# EAGLE design ns2 (EAGLE 5.09)
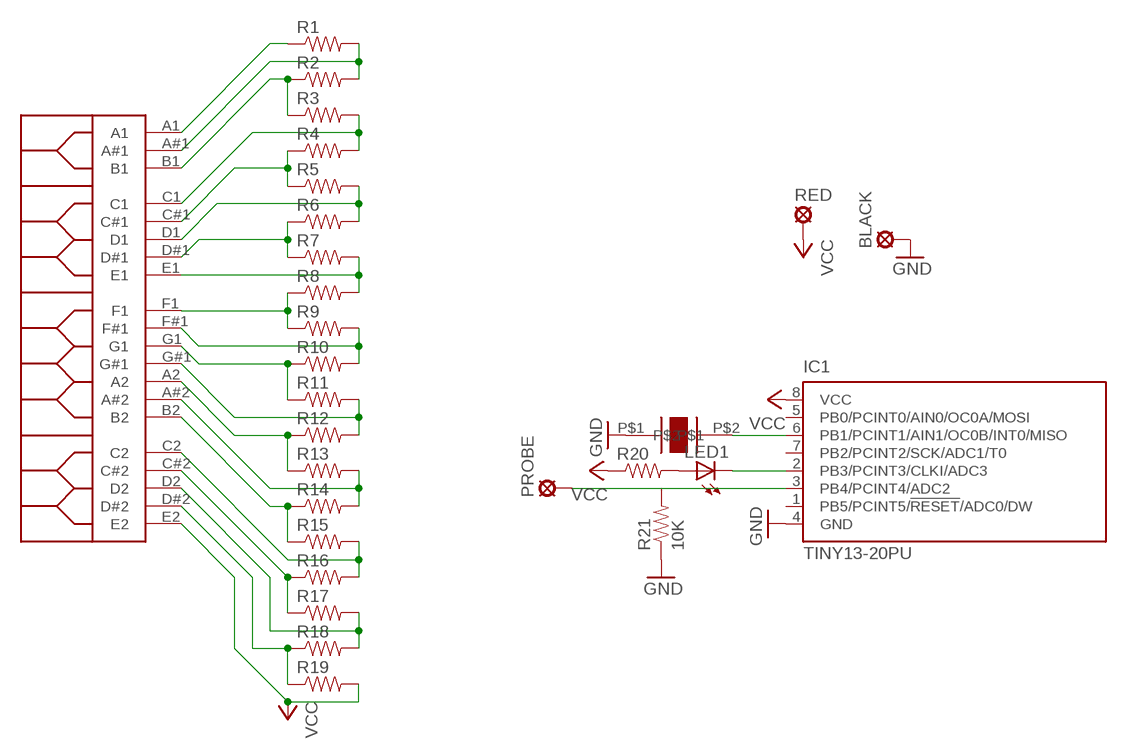
[diagram p0: schematic, sheet 1]

## Parts
BLACK  LSP10  [LSP10]
IC1  TINY13-20PU  [DIL08]
LED1  LED3MM  [LED3MM]
PROBE  LSP10  [LSP10]
R1  RESISTORPTH-1/4W  [AXIAL-0.4]
R2  RESISTORPTH-1/4W  [AXIAL-0.4]
R3  RESISTORPTH-1/4W  [AXIAL-0.4]
R4  RESISTORPTH-1/4W  [AXIAL-0.4]
R5  RESISTORPTH-1/4W  [AXIAL-0.4]
R6  RESISTORPTH-1/4W  [AXIAL-0.4]
R7  RESISTORPTH-1/4W  [AXIAL-0.4]
R8  RESISTORPTH-1/4W  [AXIAL-0.4]
R9  RESISTORPTH-1/4W  [AXIAL-0.4]
R10  RESISTORPTH-1/4W  [AXIAL-0.4]
R11  RESISTORPTH-1/4W  [AXIAL-0.4]
R12  RESISTORPTH-1/4W  [AXIAL-0.4]
R13  RESISTORPTH-1/4W  [AXIAL-0.4]
R14  RESISTORPTH-1/4W  [AXIAL-0.4]
R15  RESISTORPTH-1/4W  [AXIAL-0.4]
R16  RESISTORPTH-1/4W  [AXIAL-0.4]
R17  RESISTORPTH-1/4W  [AXIAL-0.4]
R18  RESISTORPTH-1/4W  [AXIAL-0.4]
R19  RESISTORPTH-1/4W  [AXIAL-0.4]
R20  RESISTORPTH-1/4W  [AXIAL-0.4]
R21  10K  RESISTORPTH-1/4W  [AXIAL-0.4]
RED  LSP10  [LSP10]
U$1  STYLOPHONE  STYLOPHONENANO  [NANO-KEYBOARD]
U$2  PS1420P02AT  [PS1420P02AT]

## Nets
GND: BLACK.MP IC1.4(GND) R21.P$1 U$2.P$1
N$1: R1.P$2 R2.P$2 U$1.A#1
N$2: R3.P$2 R4.P$2 U$1.C1
N$3: R5.P$2 R6.P$2 U$1.D1
N$4: R7.P$2 R8.P$2 U$1.E1
N$5: R9.P$2 R10.P$2 U$1.F#1
N$6: R11.P$2 R12.P$2 U$1.G#1
N$7: R13.P$2 R14.P$2 U$1.A#2
N$8: R15.P$2 R16.P$2 U$1.C2
N$9: R17.P$2 R18.P$2 U$1.D2
N$10: R18.P$1 R19.P$1 U$1.D#2
N$11: R16.P$1 R17.P$1 U$1.C#2
N$12: R14.P$1 R15.P$1 U$1.B2
N$13: R12.P$1 R13.P$1 U$1.A2
N$14: R10.P$1 R11.P$1 U$1.G1
N$15: R8.P$1 R9.P$1 U$1.F1
N$16: R6.P$1 R7.P$1 U$1.D#1
N$17: R4.P$1 R5.P$1 U$1.C#1
N$18: R2.P$1 R3.P$1 U$1.B1
N$19: IC1.3(PB4/PCINT4/ADC2) PROBE.MP R21.P$2
N$20: IC1.6(PB1/PCINT1/AIN1/OC0B/INT0/MISO) U$2.P$2
N$21: IC1.2(PB3/PCINT3/CLKI/ADC3) LED1.K(C)
N$22: LED1.A R20.P$2
N$23: R1.P$1 U$1.A1
VCC: IC1.8(VCC) R19.P$2 R20.P$1 RED.MP U$1.E2
Unconnected: IC1.1(PB5/PCINT5/!RESET!/ADC0/DW) IC1.5(PB0/PCINT0/AIN0/OC0A/MOSI) IC1.7(PB2/PCINT2/SCK/ADC1/T0)

## Library data of the parts
BLACK PROBE RED = solpad:LSP10: SOLDER PAD drill 1.0 mm, distributor Buerklin, 12H555
IC1 = atmel:TINY13: 8-bit AVR Microcontroller with 1K Bytes In-System Programmable Flash Source: http://www.atmel.com/dyn/resources/prod_documents/2535S.pdf
LED1 = SparkFun:LED: LEDs Standard schematic elements and footprints for 5mm, 3mm, 1206, and 0603 sized LEDs. 5mm - Spark Fun Electronics SKU : COM-00529 (and others)
R1-R21 = SparkFun:RESISTOR: Resistor Basic schematic elements and footprints for 0603, 1206, and PTH resistors.
U$1 = stlkb:STYLOPHONE
U$2 = piezo:PS1420P02AT

## Board
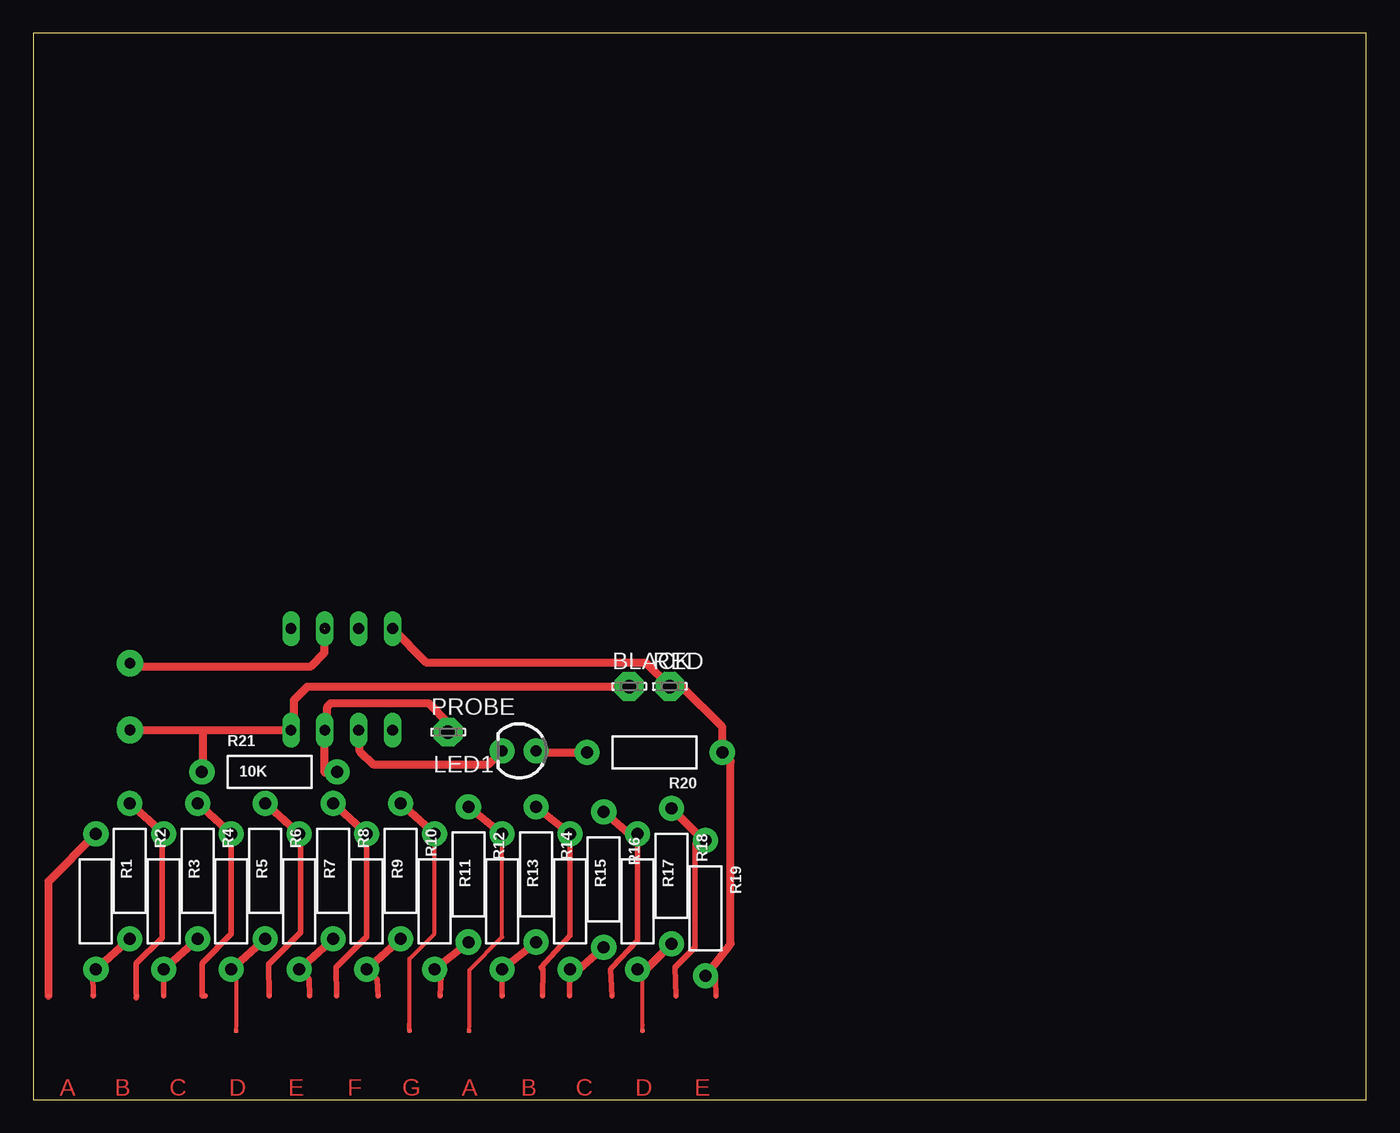
[diagram p1: board, top side]
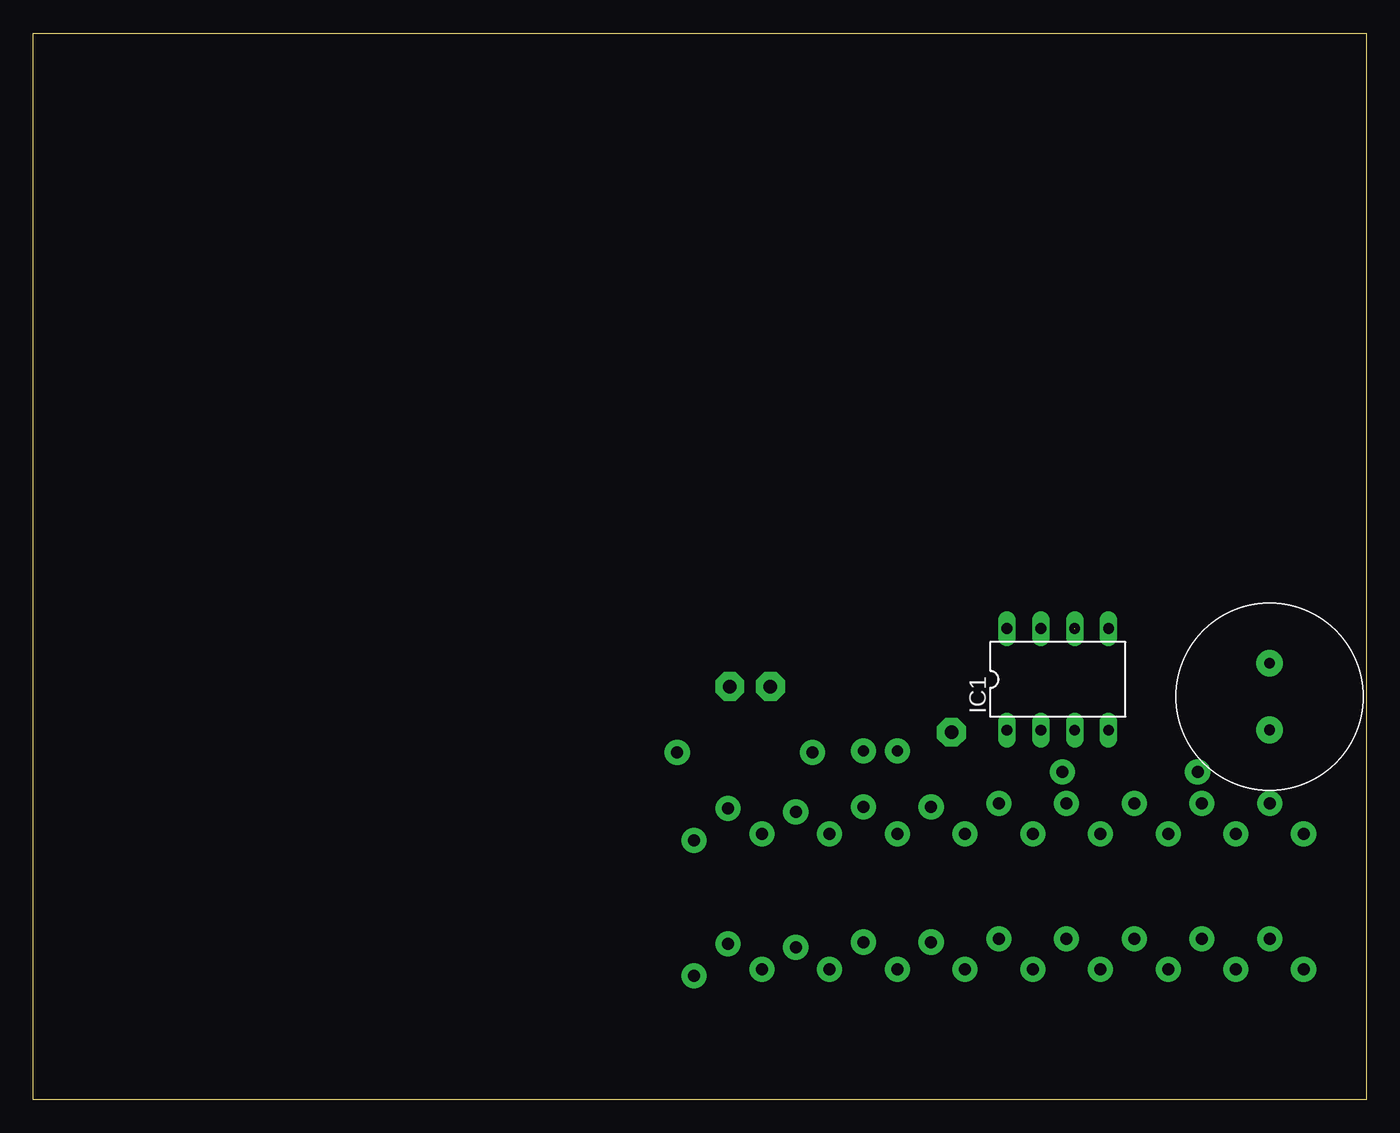
[diagram p2: board, bottom side, seen from below]

Size 100 x 80 mm. Coordinates in mm from the lower left corner, seen from the top.
Outline: 0,0 100,0 100,80 0,80 0,0
Copper layers (1*16): Top 0.035mm / dielectric 1.5mm / Bottom 0.035mm
Design rules "default": minimum track width 10mil, minimum drill 24mil, track to track 8mil, track to pad 8mil, pad to pad 8mil, via to via 8mil, smd to smd 8mil, copper to edge 40mil, drill to drill 8mil, minimum pad ring 10mil, minimum via ring 8mil, stop-mask expansion 4mil, vias tented up to drill 0mil, thermal gap 10mil

### Footprints (pad centres in the part's own frame; a part is rotated, then mirrored left to right if it is on the bottom)
LSP10 = drill 1.016 pad 2.159 octagon: MP 0,0
DIL08 = drill 0.813 long: 1 -3.81,-3.81; 2 -1.27,-3.81; 3 1.27,-3.81; 4 3.81,-3.81; 5 3.81,3.81; 6 1.27,3.81; 7 -1.27,3.81; 8 -3.81,3.81
LED3MM = drill 0.813 pad 1.88 round: A -1.27,0; K 1.27,0
AXIAL-0.4 = drill 0.9 pad 1.88 round: P$1 -5.08,0; P$2 5.08,0
NANO-KEYBOARD = smd 0.305 x 0.152: A1 0.762,-0.076; A2 32.309,-2.718; A#1 4.115,-0.076; A#2 34.798,-0.076; B1 7.366,-0.076; B2 37.821,-0.076; C1 9.398,-0.076; C2 39.853,-0.076; C#1 12.497,-0.076; C#2 43.028,-0.076; D1 14.834,-2.718; D2 45.314,-2.718; D#1 17.323,-0.076; D#2 47.828,-0.076; E1 20.345,-0.076; E2 50.825,-0.076; F1 22.377,-0.076; F#1 25.502,-0.076; G1 27.838,-2.718; G#1 30.15,-0.076
PS1420P02AT = drill 0.8 pad 2 round: P$1 -2.5,0; P$2 2.5,0

### Placement (x,y rotation side)
BLACK  44.7,30.99 0 top
IC1  23.14,31.52 0 bottom
LED1  36.45,26.16 180 top
PROBE  31.11,27.56 0 top
R1  4.7,14.86 270 top
R2  7.24,17.14 270 top
R3  9.78,14.86 270 top
R4  12.32,17.14 270 top
R5  14.86,14.86 270 top
R6  17.4,17.14 270 top
R7  19.94,14.86 270 top
R8  22.48,17.14 270 top
R9  25.02,14.86 270 top
R10  27.56,17.14 270 top
R11  30.1,14.86 270 top
R12  32.64,16.89 270 top
R13  35.18,14.86 270 top
R14  37.72,16.89 270 top
R15  40.26,14.86 270 top
R16  42.8,16.51 270 top
R17  45.34,14.86 270 top
R18  47.88,16.76 270 top
R19  50.42,14.35 270 top
R20  46.61,26.04 180 top
R21  17.73,24.59 0 top
RED  47.75,30.99 0 top
U$1  0.38,7.87 0 top
U$2  7.24,30.23 90 bottom

### Tracks (layer width: path | path; a pad name or v marks a point on that pad's centre or on a via)
GND
  Top 0.61: BLACK.MP 20.57,30.99 19.56,29.97 19.56,27.94 IC1.4 19.32,27.73 12.7,27.73 | U$2.P$1 12.7,27.73 | R21.P$1 12.7,24.64 12.7,27.73
N$1
  Top 0.406: R1.P$2 4.45,9.53 U$1.A#1
  Top 0.61: R1.P$2 R2.P$2
N$2
  Top 0.406: U$1.C1 R3.P$2
  Top 0.61: R3.P$2 R4.P$2
N$3
  Top 0.305: R5.P$2 15.24,9.4 15.24,5.59 U$1.D1
  Top 0.61: R5.P$2 R6.P$2
N$4
  Top 0.406: R7.P$2 20.7,9.02 U$1.E1
  Top 0.61: R7.P$2 R8.P$2
N$5
  Top 0.406: R9.P$2 25.78,9.02 U$1.F#1
  Top 0.61: R9.P$2 R10.P$2
N$6
  Top 0.406: R11.P$2 30.61,9.27 U$1.G#1
  Top 0.61: R11.P$2 R12.P$2
N$7
  Top 0.406: U$1.A#2 R13.P$2
  Top 0.61: R13.P$2 R14.P$2
N$8
  Top 0.406: U$1.C2 R15.P$2
  Top 0.61: R16.P$2 40.89,9.78 R15.P$2
N$9
  Top 0.305: 45.72,9.4 45.72,5.59 U$1.D2
  Top 0.406: 45.72,9.4 R17.P$2
  Top 0.61: R18.P$2 45.97,9.78 R17.P$2
N$10
  Top 0.406: R19.P$1 49.66,19.18 49.66,11.43 48.13,9.91 U$1.D#2
  Top 0.61: R18.P$1 49.78,19.94 R19.P$1
N$11
  Top 0.406: R17.P$1 45.34,11.94 43.43,9.91 43.31,9.78 U$1.C#2
  Top 0.61: R16.P$1 44.7,19.94 R17.P$1
N$12
  Top 0.406: R15.P$1 40.26,12.32 38.1,9.91 38.23,9.78 U$1.B2
  Top 0.61: R15.P$1 R14.P$1
N$13
  Top 0.305: R13.P$1 35.18,12.19 32.72,9.73 32.72,5.61 U$1.A2
  Top 0.61: R13.P$1 R12.P$1
N$14
  Top 0.305: R11.P$1 30.1,12.45 28.22,10.57 28.22,5.79 arc16 U$1.G1
  Top 0.61: R11.P$1 R10.P$1
N$15
  Top 0.406: R9.P$1 25.02,12.19 22.73,9.91 U$1.F1
  Top 0.61: R9.P$1 R8.P$1
N$16
  Top 0.406: R7.P$1 20.07,19.81 20.07,12.55 17.65,10.13 U$1.D#1
  Top 0.61: R7.P$1 R6.P$1
N$17
  Top 0.406: R5.P$1 14.86,12.42 12.68,10.24 12.68,7.77 U$1.C#1
  Top 0.61: R5.P$1 R4.P$1
N$18
  Top 0.406: R3.P$1 9.65,19.81 9.65,12.14 7.72,10.21 7.72,7.64 U$1.B1
  Top 0.61: R3.P$1 R2.P$1
N$19
  Top 0.61: R21.P$2 21.87,24.51 IC1.3 21.89,27.69 22.05,27.84 22.05,29.46 22.33,29.74 29.64,29.74 31.11,28.27 PROBE.MP
N$20  (1 unrouted)
  Top 0.61: 21.84,35.31 21.84,33.53 20.83,32.51 7.45,32.51 U$2.P$2
N$21
  Top 0.61: LED1.K 34.16,25.15 25.48,25.15 24.49,26.14 24.49,27.64 IC1.2
N$22
  Top 0.61: LED1.A 37.85,26.04 R20.P$2
N$23
  Top 0.61: U$1.A1 1.14,16.38 R1.P$1
VCC
  Top 0.406: R19.P$2 51.18,9.02 U$1.E2
  Top 0.61: R19.P$2 52.32,11.68 52.32,25.4 R20.P$1 51.69,27.94 48.64,30.99 RED.MP 45.97,32.77 29.52,32.77 IC1.8